# EasyEDA Pro project NDSL震动卡.epro

# Schematic Schematic1
Board Name: Board1; Create Date: 2024-07-23; Page Name: P1; Project Name: ndsl震动; Schematic Name: Schematic1; Update Date: 2024-07-23; Company: 嘉立创EDA; Page Size: A4; Version: V1.0
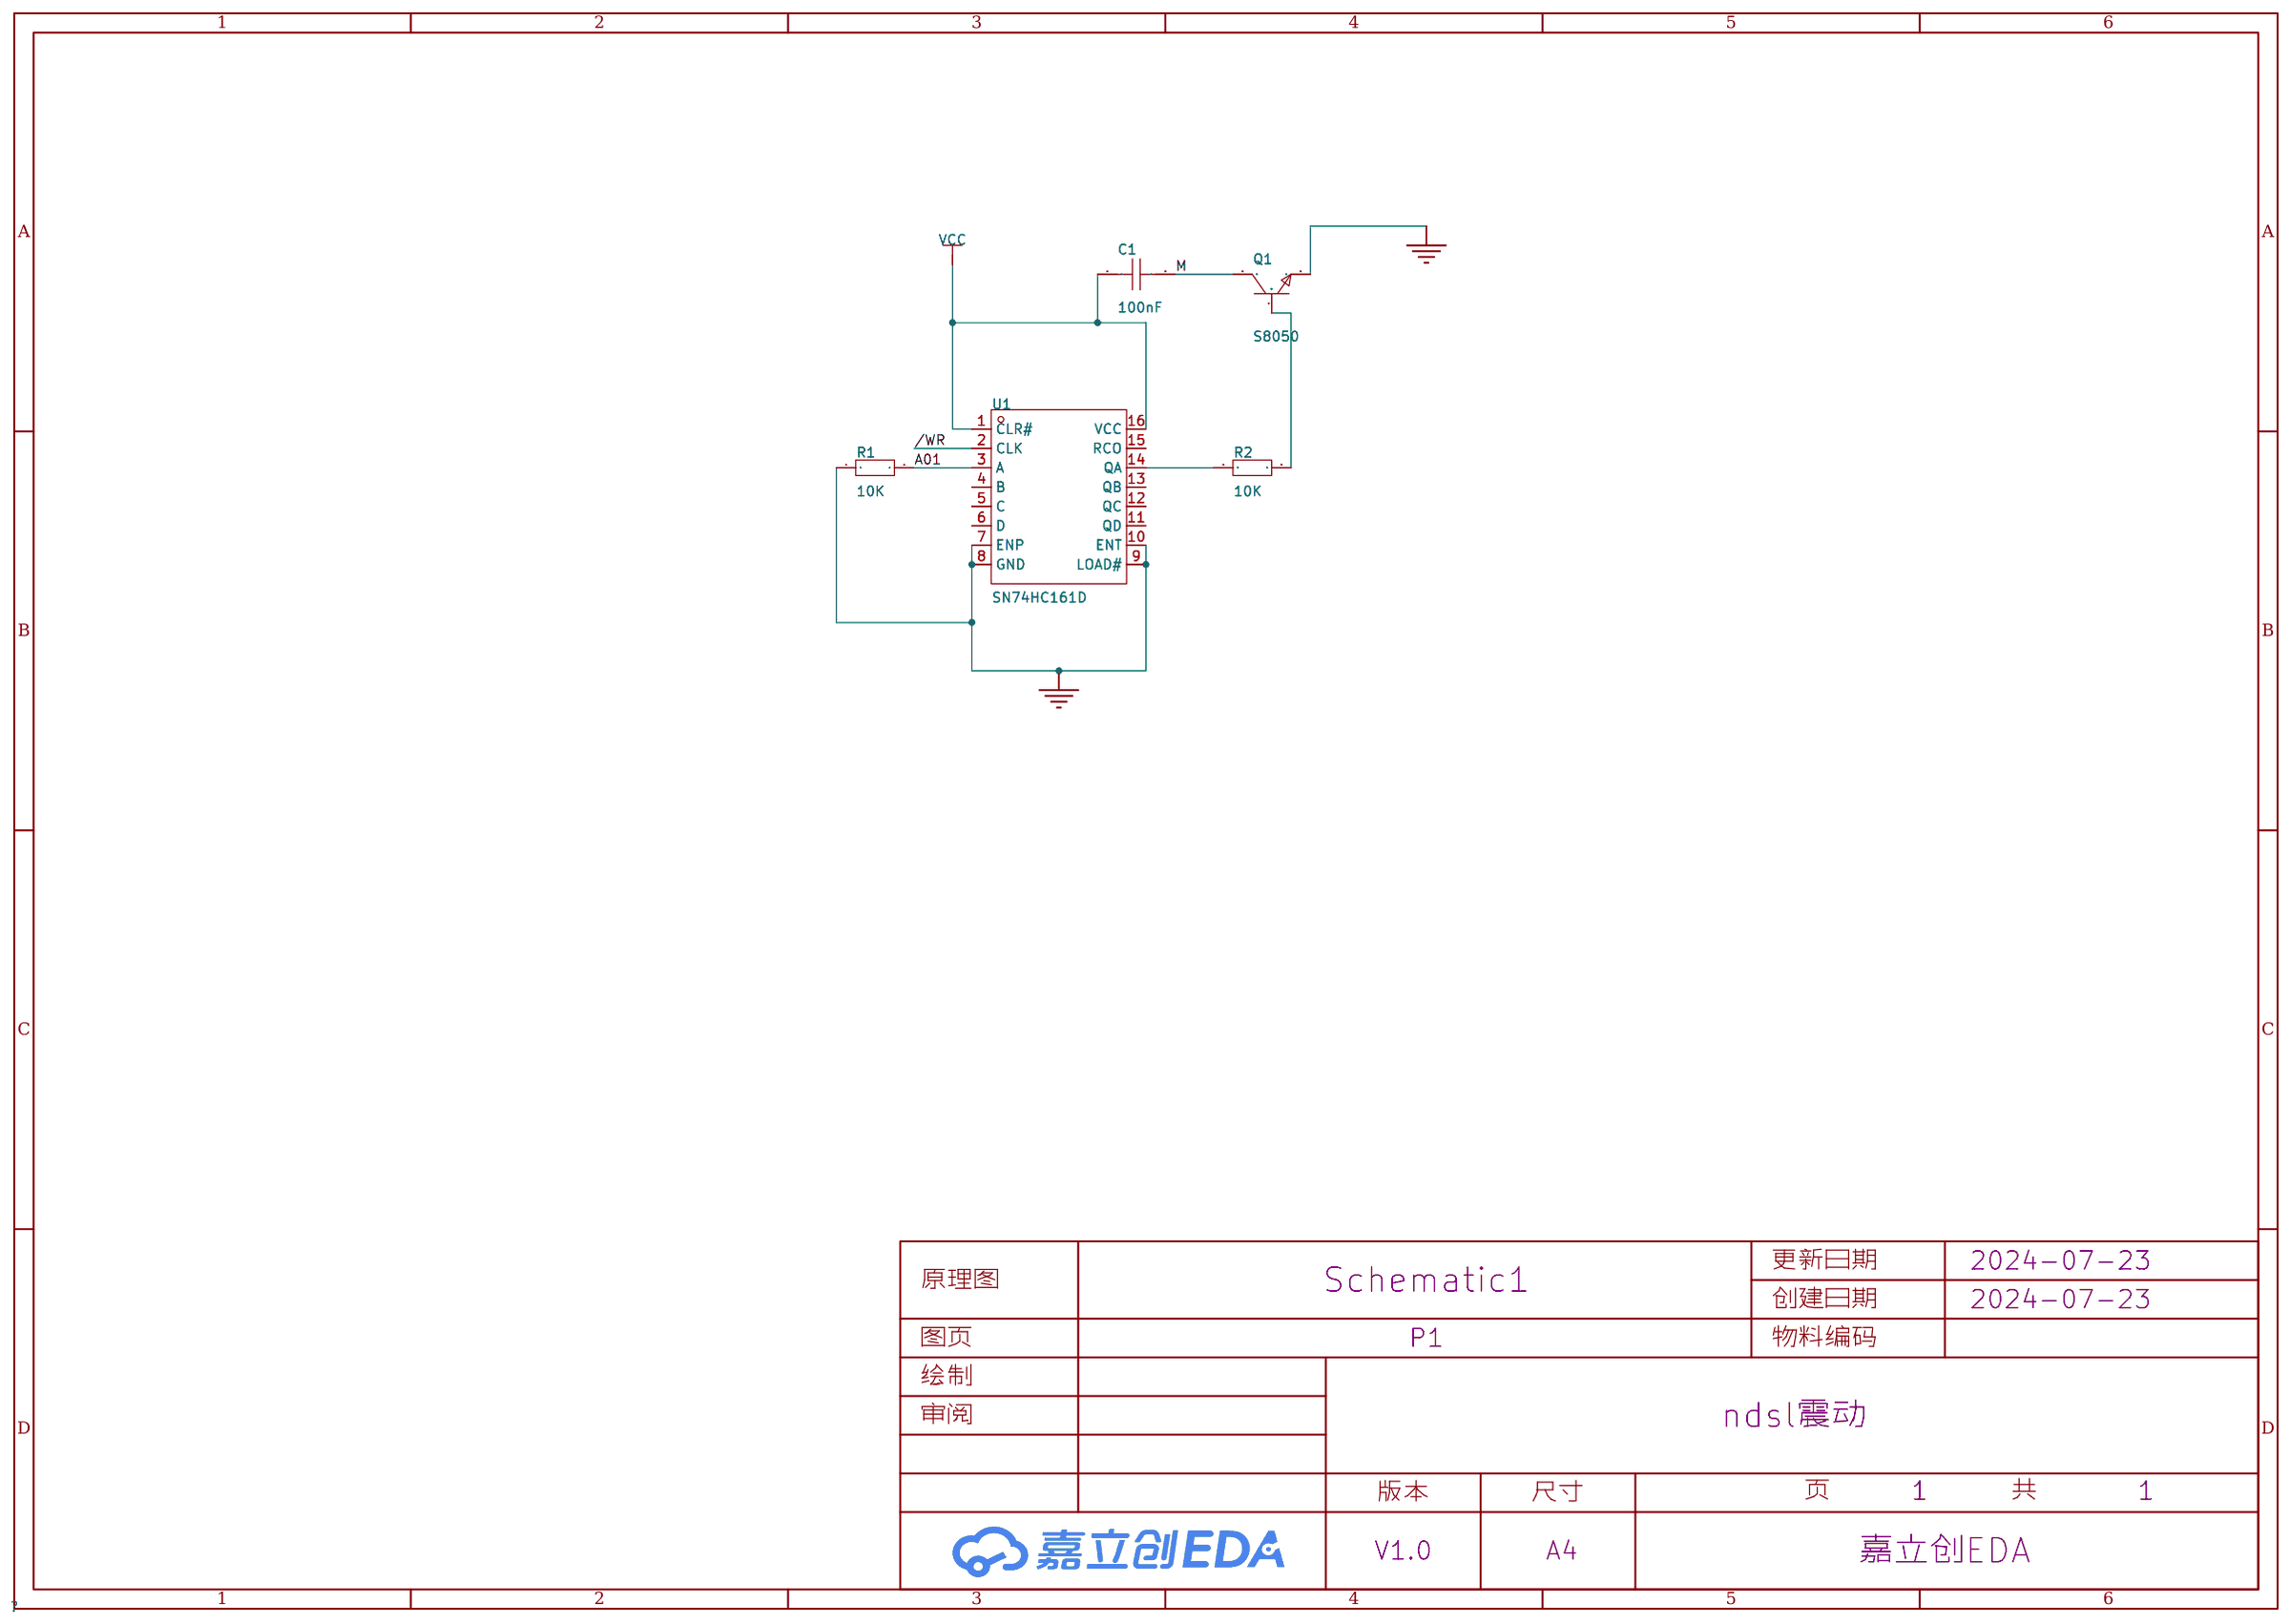
[diagram p0: schematic sheet]

## Parts
C1  100nF  [C1206]
Q1  S8050  [SOT-23-3_L2.9-W1.3-P1.90-LS2.3-BR]
R1  10K  [R1206]
R2  10K  [R1206]
U1  SN74HC161D  [SOIC-16_L9.9-W3.9-P1.27-LS6.0-BL]

## Library data of the parts
C1 = CAP_1206: Supplier Footprint: 1206
Q1 = S8050_C20069125: 晶体管类型:NPN;集电极电流(Ic):500mA;集射极击穿电压(Vceo):25V;功率(Pd):300mW;直流电流增益(hFE@Ic,Vce):120@50mA,1.0V;; LCSC Part Name: NPN 电流:500mA 耐压:25V; Supplier Part: C20069125; Manufacturer: 宏迦橙; Supplier Footprint: SOT-23; JLCPCB Part Class: 扩展库; Datasheet: https://atta.szlcsc.com/upload/public/pdf/source/20240403/2D78449C96B6E27F13BF8BDF79E27159.pdf; Supplier: LCSC; Transistor Type: NPN; Collector Current (Ic): 500mA; Collector-Emitter Breakdown Voltage (Vceo): 25V; Power Dissipation (Pd): 300mW; DC Current Gain (hFE@Ic,Vce): 120@50mA,1.0V; Transition Frequency (fT): 100MHz; Collector Cut-Off Current (Icbo): 100nA; Collector-Emitter Saturation Voltage (VCE(sat)@Ic,Ib): 600mV@500mA,50mA; Operating Temperature: -55℃~+150℃
R1 R2 = Res_1206: Supplier Footprint: 1206
U1 = SN74HC161D: 工作电压:2V~6V;元件数:1;每个元件位数:4;触发器类型:正边沿;计数速率:36MHz;; LCSC Part Name: 36MHz 4位二进制计数器; Supplier Part: C1523324; Manufacturer: TI(德州仪器); Supplier Footprint: SOIC-16; JLCPCB Part Class: 扩展库; Datasheet: https://www.ti.com/cn/lit/gpn/sn74hc161; Supplier: LCSC; Logic Type: 二进制计数器; Direction: 向上计数器; Supply Voltage: 2V~6V; Number of Elements: 1; Number of Bits per Element: 4; Trigger Type: 正边沿; Reset Style: 异步; Timing mode: 同步; Count Rate: 36MHz; Operating Temperature: -40℃~+85℃

## Nets
GND: Q1.2(E) R1.1 U1.7(ENP) U1.8(GND) U1.9(LOAD#) U1.10(ENT)
VCC: C1.1 U1.1(CLR#) U1.16(VCC)
/WR: U1.2(CLK)
A01: R1.2 U1.3(A)
M: C1.2 Q1.3(C)
$1N586: R2.1 U1.14(QA)
$1N721: Q1.1(B) R2.2

Not connected (* = marked no-connect by the designer): U1 4(B) 5(C) 6(D) 11(QD) 12(QC) 13(QB) 15(RCO)

# Board ndsl震动
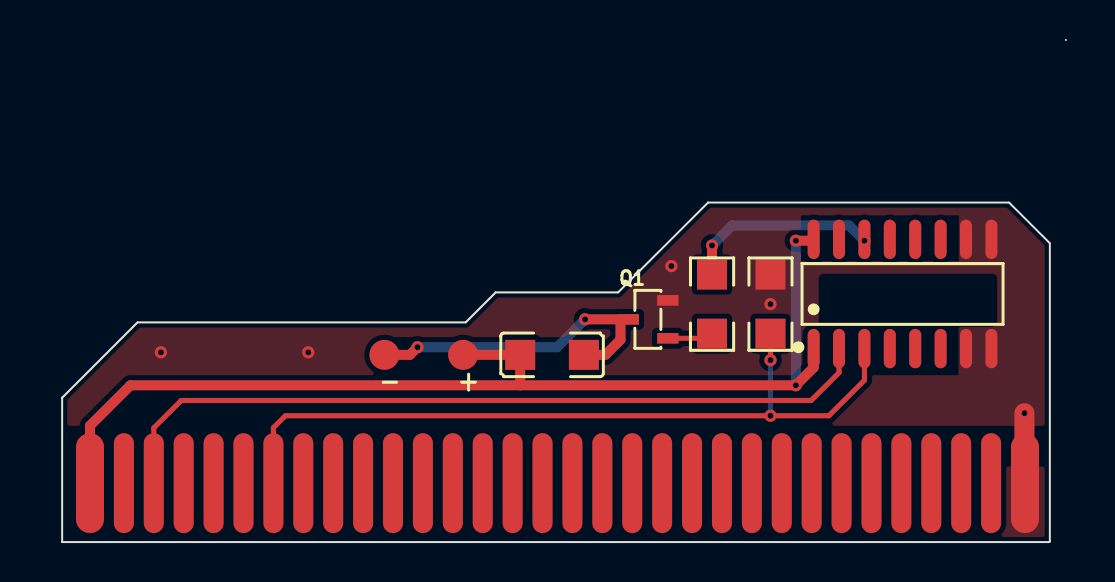
[diagram p1: board, top side]
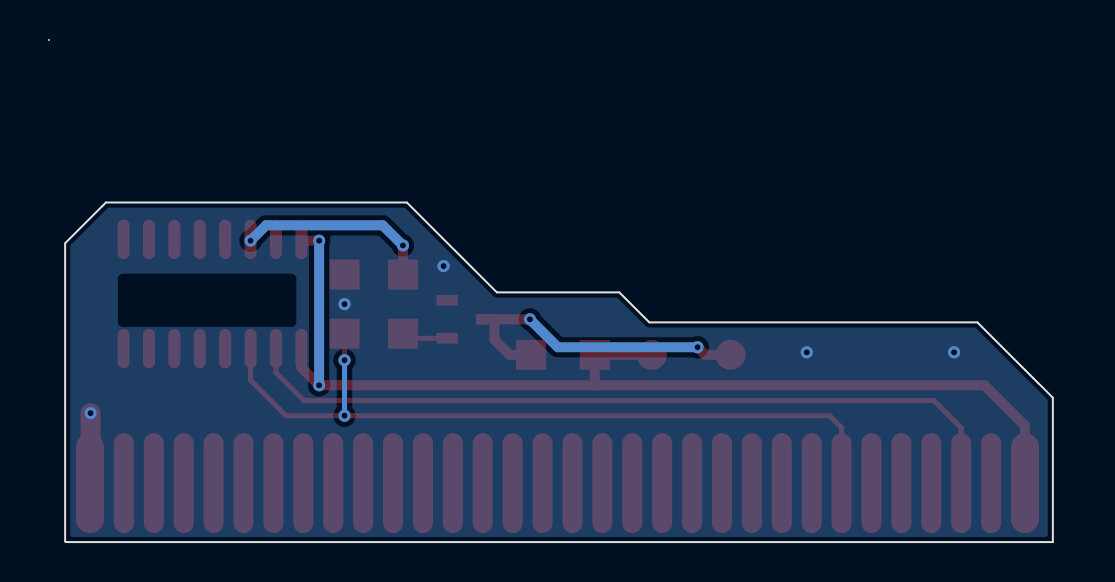
[diagram p2: board, bottom side, seen from below]

Outline 50.19 x 25.14 mm; copper layers: Top Layer, Bottom Layer. Coordinates in mm from the lower left corner of the outline.
Outline path: 0,7.23 3.77,11 20.18,11 21.68,12.5 27.8,12.5 32.3,17 47.35,17 49.39,14.96 49.39,0.03 49.36,0 0,0 0,7.23
Stack: Top Layer 0.035mm / Dielectric1 1.51mm FR4 er 4.5 / Bottom Layer 0.035mm

## Design rules (mm)
template: 自定义配置
spacing copperThickness1oz (default): track to track 0.102, other pairs 0.152 to 0.3
spacing copperThickness2oz: track to track 0.203, other pairs 0.152 to 0.3
track width copperThickness1oz (default): min 0.127, default 0.254, max 2.54
track width copperThickness2oz: min 0.203, default 0.254, max 2.54
differential pair differentialPair (default): width min 0.127, default 0.254, max 2.54; gap min 0.152, default 0.152
via viaSize (default): diameter min 0.5, default 0.61, max 10; hole min 0.3, default 0.305, max 6.3

## Placement (name value [footprint] x y rotation side)
C1  100nF  [c1206]  24.5 9.37 0 top
NOREF  -  [Pad_e74]  19.54 2.95 180 top
NOREF#2  -  [Pad_e51]  15.05 2.95 180 top
NOREF#3  -  [Pad_e170]  46.45 2.95 180 top
NOREF#4  -  [Pad_e104]  27.01 2.95 180 top
NOREF#5  -  [Pad_e37]  10.56 2.95 180 top
NOREF#6  -  [Pad_e125]  32.99 2.95 180 top
NOREF#7  -  [Pad_e166]  44.96 2.95 180 top
NOREF#8  -  [Pad_e80]  21.03 2.95 180 top
NOREF#9  -  [Pad_e20]  6.08 2.95 180 top
NOREF#10  -  [Pad_e161]  43.46 2.95 180 top
NOREF#11  -  [Pad_e25]  7.57 2.95 180 top
NOREF#12  -  [Pad_e119]  31.5 2.95 180 top
NOREF#13  -  [Pad_e156]  41.97 2.95 180 top
NOREF#14  -  [Pad_e129]  34.49 2.95 180 top
NOREF#15  -  [Pad_e43]  12.06 2.95 180 top
NOREF#16  -  [Pad_e86]  22.53 2.95 180 top
NOREF#17  -  [Pad_e144]  37.48 2.95 180 top
NOREF#18  -  [Pad_e100]  25.52 2.95 180 top
NOREF#19  -  [Pad_e148]  16.11 9.37 0 top
NOREF#20  -  [Pad_e92]  24.02 2.95 180 top
NOREF#21  -  [Pad_e9]  3.09 2.95 180 top
NOREF#22  -  [Pad_e4]  1.39 2.95 180 top
NOREF#23  -  [Pad_e174]  48.15 2.95 180 top
NOREF#24  -  [Pad_e31]  9.07 2.95 180 top
NOREF#25  -  [Pad_e68]  18.04 2.95 180 top
NOREF#26  -  [Pad_e59]  16.54 2.95 180 top
NOREF#27  -  [Pad_e145]  38.97 2.95 180 top
NOREF#28  -  [Pad_e47]  13.55 2.95 180 top
NOREF#29  -  [Pad_e150]  40.47 2.95 180 top
NOREF#30  -  [Pad_e141]  20.05 9.37 0 top
NOREF#31  -  [Pad_e16]  4.58 2.95 180 top
NOREF#32  -  [Pad_e115]  30 2.95 180 top
NOREF#33  -  [Pad_e109]  28.51 2.95 180 top
NOREF#34  -  [Pad_e138]  35.98 2.95 180 top
Q1  S8050  [SOT-23-3_L2.9-W1.3-P1.90-LS2.3-BR]  29.3 11.15 0 top
R1  10K  [r1206]  35.42 11.91 270 top
R2  10K  [r1206]  32.5 11.91 270 top
U1  SN74HC161D  [SOIC-16_L9.9-W3.9-P1.27-LS6.0-BL]  42.02 12.42 0 top

## Footprints (pads in the part's own frame, mm; a bottom-side part is the same pattern mirrored in y, then rotated)
c1206
  rect 1.5x1.5 smd: 1(-1.593,0) 2(1.593,0)
Pad_e4
  oval 1.4x5 smd: 1(0,0)
Pad_e9
  oval 1x5 smd: 2(0,0)
Pad_e16
  oval 1x5 smd: 1(0,0)
Pad_e20
  oval 1x5 smd: 1(0,0)
Pad_e25
  oval 1x5 smd: 1(0,0)
Pad_e31
  oval 1x5 smd: 1(0,0)
Pad_e37
  oval 1x5 smd: 1(0,0)
Pad_e43
  oval 1x5 smd: 1(0,0)
Pad_e47
  oval 1x5 smd: 1(0,0)
Pad_e51
  oval 1x5 smd: 1(0,0)
Pad_e59
  oval 1x5 smd: 1(0,0)
Pad_e68
  oval 1x5 smd: 1(0,0)
Pad_e74
  oval 1x5 smd: 1(0,0)
Pad_e80
  oval 1x5 smd: 1(0,0)
Pad_e86
  oval 1x5 smd: 1(0,0)
Pad_e92
  oval 1x5 smd: 1(0,0)
Pad_e100
  oval 1x5 smd: 1(0,0)
Pad_e104
  oval 1x5 smd: 1(0,0)
Pad_e109
  oval 1x5 smd: 1(0,0)
Pad_e115
  oval 1x5 smd: 1(0,0)
Pad_e119
  oval 1x5 smd: 1(0,0)
Pad_e125
  oval 1x5 smd: 1(0,0)
Pad_e129
  oval 1x5 smd: 1(0,0)
Pad_e138
  oval 1x5 smd: 1(0,0)
Pad_e141
  round 1.5 smd: 17(0,0)
Pad_e144
  oval 1x5 smd: 1(0,0)
Pad_e145
  oval 1x5 smd: 1(0,0)
Pad_e148
  round 1.5 smd: 18(0,0)
Pad_e150
  oval 1x5 smd: 1(0,0)
Pad_e156
  oval 1x5 smd: 1(0,0)
Pad_e161
  oval 1x5 smd: 1(0,0)
Pad_e166
  oval 1x5 smd: 1(0,0)
Pad_e170
  oval 1x5 smd: 1(0,0)
Pad_e174
  oval 1.4x5 smd: 32(0,0)
r1206
  rect 1.5x1.5 smd: 1(-1.479,0) 2(1.479,0)
SOIC-16_L9.9-W3.9-P1.27-LS6.0-BL
  oval 0.602x1.971 smd: 1(-4.445,-2.736) 2(-3.175,-2.736) 3(-1.905,-2.736) 4(-0.635,-2.736) 5(0.635,-2.736) 6(1.905,-2.736) 7(3.175,-2.736) 8(4.445,-2.736) 9(4.445,2.736) 10(3.175,2.736) 11(1.905,2.736) 12(0.635,2.736) 13(-0.635,2.736) 14(-1.905,2.736) 15(-3.175,2.736) 16(-4.445,2.736)
SOT-23-3_L2.9-W1.3-P1.90-LS2.3-BR
  rect 1.07x0.532 smd: 1(0.99,-0.95) 2(0.99,0.95) 3(-0.99,0)

## Nets
As in the schematic, except:
GND: NOREF#23.32 Q1.2 R1.1 U1.7 U1.8 U1.9 U1.10
VCC: C1.1 NOREF#22.1 NOREF#30.17 U1.1 U1.16
/WR: NOREF#31.1 U1.2
A01: NOREF#5.1 R1.2 U1.3
M: C1.2 NOREF#19.18 Q1.3

Pads without a net: U1 4 5 6 11 12 13 15

## Via types
v1: diameter 0.61, hole 0.305, Top Layer to Bottom Layer, 13 vias

## Routing (per net, layer and track width the routed paths; a pad name or vN(x,y) marks a point on that pad's centre or on a via; arc(x,y) is an arc through that point)
GND: length 3.5
  Top Layer w1: v1(48.12,6.45) 48.12,2.98 NOREF#23.32
  vias: v1(4.94,9.5) v1(12.3,9.5) v1(30.47,13.82) v1(35.42,11.91)
VCC: length 53.8
  Top Layer w0.5: NOREF#22.1 1.39,5.83 3.42,7.85 22.91,7.85 ; v1(36.69,15.09) 37.51,15.09 U1.16 ; 22.91,7.85 22.9,7.86 C1.1 NOREF#30.17 ; 22.91,7.85 v1(36.69,7.85) 37.58,8.74 U1.1
  Bottom Layer w0.5: v1(36.69,7.85) v1(36.69,15.09)
/WR: length 39.4
  Top Layer w0.254: U1.2 38.85,8.48 37.45,7.09 5.95,7.09 4.58,5.72 NOREF#31.1
A01: length 39
  Top Layer w0.254: v1(35.42,9.11) R1.2 ; U1.3 40.12,8.1 38.34,6.33 v1(35.42,6.33) 11.16,6.33 10.56,5.73 NOREF#5.1
  Bottom Layer w0.254: v1(35.42,6.33) v1(35.42,9.11)
M: length 15.7
  Top Layer w0.5: NOREF#19.18 17.39,9.37 v1(17.77,9.75) ; C1.2 27.16,9.37 27.92,10.13 27.92,11.15 v1(26.15,11.15)
  Bottom Layer w0.5: v1(26.15,11.15) 24.75,9.75 v1(17.77,9.75)
$1N586: length 10.6
  Top Layer w0.254: U1.14 40.12,15.98
  Top Layer w0.5: R2.1 v1(32.5,14.85)
  Bottom Layer w0.5: v1(40.12,15.09) 39.35,15.86 33.51,15.86 v1(32.5,14.85)
$1N721: length 2.4
  Top Layer w0.254: 30.22,10.2 32.27,10.2 R2.2

## Copper pours and planes (outline as drawn; the poured copper is in the pictures)
GND on Top Layer: -0.14,17.38 49.77,17.38 49.77,-0.28 -0.14,-0.28
GND on Bottom Layer: -1.28,18.14 50.72,18.14 50.72,0.03 -1.28,0.03

## Text on the board
Top Silkscreen Layer: - | +
